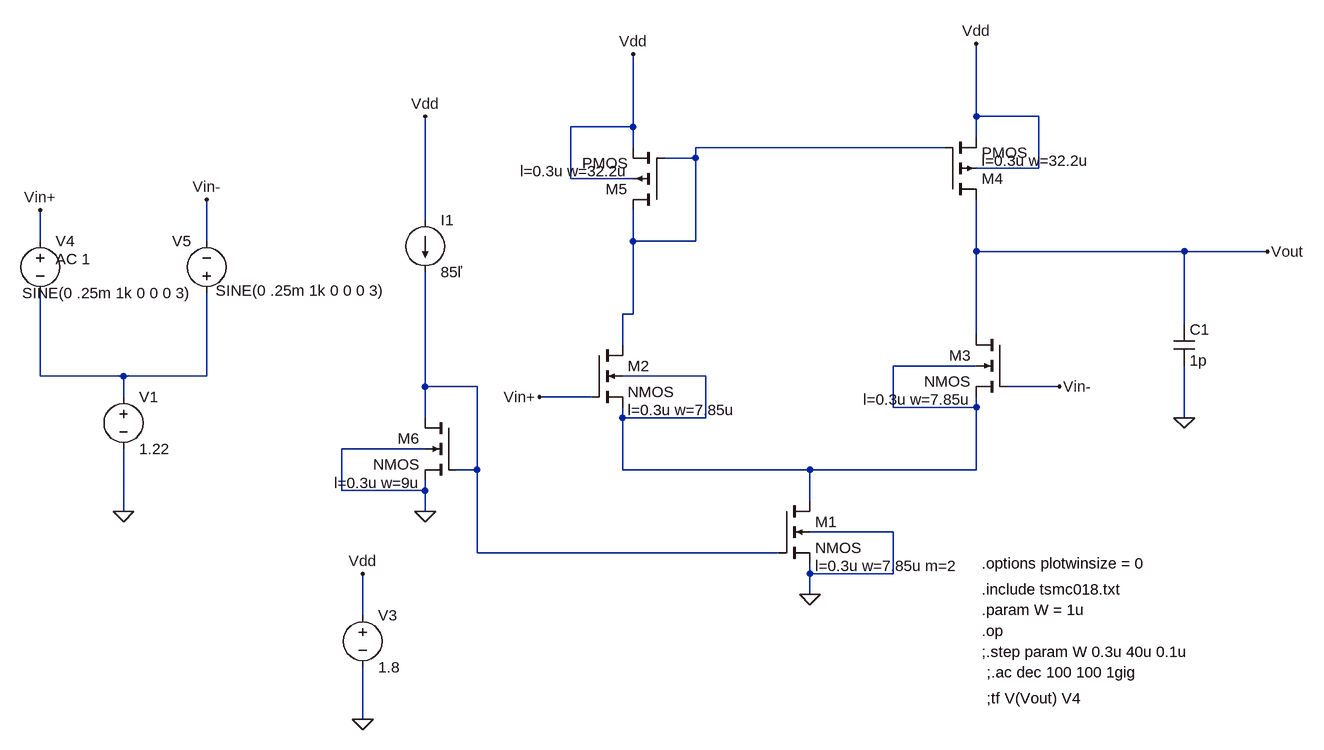
[diagram p0: schematic Op-Amp.asc]
Op-Amp.asc, the LTspice schematic file:
Version 4
SHEET 1 1016 680
WIRE 496 -384 496 -496
WIRE 592 -384 496 -384
WIRE -32 -368 -32 -480
WIRE -32 -368 -128 -368
WIRE 496 -352 496 -384
WIRE -32 -336 -32 -368
WIRE 448 -336 64 -336
WIRE 64 -320 64 -336
WIRE 64 -320 16 -320
WIRE 592 -304 592 -384
WIRE 592 -304 496 -304
WIRE -128 -288 -128 -368
WIRE -32 -288 -128 -288
WIRE -352 -224 -352 -384
WIRE -944 -192 -944 -240
WIRE -688 -192 -688 -256
WIRE -32 -192 -32 -240
WIRE 64 -192 64 -320
WIRE 64 -192 -32 -192
WIRE 496 -176 496 -256
WIRE 816 -176 496 -176
WIRE 944 -176 816 -176
WIRE -32 -80 -32 -192
WIRE -32 -80 -48 -80
WIRE 816 -64 816 -176
WIRE 496 -48 496 -176
WIRE -48 -32 -48 -80
WIRE 496 0 368 0
WIRE -944 16 -944 -112
WIRE -816 16 -944 16
WIRE -688 16 -688 -112
WIRE -688 16 -816 16
WIRE 80 16 -48 16
WIRE -352 32 -352 -144
WIRE -272 32 -352 32
WIRE 624 32 544 32
WIRE -816 48 -816 16
WIRE -96 48 -176 48
WIRE 368 64 368 0
WIRE 496 64 496 48
WIRE 496 64 368 64
WIRE -352 80 -352 32
WIRE -48 80 -48 64
WIRE 80 80 80 16
WIRE 80 80 -48 80
WIRE 816 80 816 0
WIRE -352 128 -480 128
WIRE -272 160 -272 32
WIRE -272 160 -304 160
WIRE -48 160 -48 80
WIRE 240 160 -48 160
WIRE 496 160 496 64
WIRE 496 160 240 160
WIRE -480 192 -480 128
WIRE -352 192 -352 176
WIRE -352 192 -480 192
WIRE 240 208 240 160
WIRE -816 224 -816 128
WIRE -352 224 -352 192
WIRE 368 256 240 256
WIRE -272 288 -272 160
WIRE 192 288 -272 288
WIRE 240 320 240 304
WIRE 368 320 368 256
WIRE 368 320 240 320
WIRE 240 352 240 320
WIRE -448 384 -448 320
WIRE -448 544 -448 464
FLAG 240 352 0
FLAG -32 -480 Vdd
FLAG -448 544 0
FLAG -448 320 Vdd
FLAG 496 -496 Vdd
FLAG -944 -240 Vin+
FLAG -688 -256 Vin-
FLAG 944 -176 Vout
FLAG 816 80 0
FLAG -176 48 Vin+
FLAG 624 32 Vin-
FLAG -816 224 0
FLAG -352 224 0
FLAG -352 -384 Vdd
SYMBOL nmos4 192 208 R0
WINDOW 123 56 100 Left 2
SYMATTR Value2 l=0.3u w=7.85u m=2
SYMATTR InstName M1
SYMBOL voltage -816 32 R0
WINDOW 123 0 0 Left 0
WINDOW 39 0 0 Left 0
SYMATTR InstName V1
SYMATTR Value 1.22
SYMBOL nmos4 -96 -32 R0
WINDOW 123 56 100 Left 2
SYMATTR Value2 l=0.3u w=7.85u
SYMATTR InstName M2
SYMBOL nmos4 544 -48 M0
WINDOW 123 56 100 Left 2
SYMATTR Value2 l=0.3u w=7.85u
SYMATTR InstName M3
SYMBOL pmos4 16 -240 R180
WINDOW 123 56 60 Left 2
SYMATTR Value2 l=0.3u w=32.2u
SYMATTR InstName M5
SYMBOL voltage -448 368 R0
WINDOW 123 0 0 Left 0
WINDOW 39 24 124 Left 2
SYMATTR InstName V3
SYMATTR Value 1.8
SYMBOL pmos4 448 -256 M180
WINDOW 123 56 60 Left 2
SYMATTR Value2 l=0.3u w=32.2u
SYMATTR InstName M4
SYMBOL voltage -944 -208 R0
WINDOW 3 270 92 Left 2
WINDOW 123 24 44 Left 2
WINDOW 39 0 0 Left 0
SYMATTR Value SINE(0 .25m 1k 0 0 0 3)
SYMATTR Value2 AC 1
SYMATTR InstName V4
SYMBOL voltage -688 -96 R180
WINDOW 0 24 96 Left 2
WINDOW 3 24 16 Left 2
WINDOW 123 0 0 Left 0
WINDOW 39 0 0 Left 0
SYMATTR InstName V5
SYMATTR Value SINE(0 .25m 1k 0 0 0 3)
SYMBOL cap 800 -64 R0
SYMATTR InstName C1
SYMATTR Value 1p
SYMBOL nmos4 -304 80 M0
WINDOW 123 56 100 Left 2
SYMATTR Value2 l=0.3u w=9u
SYMATTR InstName M6
SYMBOL current -352 -224 R0
WINDOW 123 0 0 Left 0
WINDOW 39 0 0 Left 0
SYMATTR InstName I1
SYMATTR Value 85ľ
TEXT 504 304 Left 2 !.options plotwinsize = 0
TEXT 504 344 Left 2 !.include tsmc018.txt
TEXT 504 376 Left 2 !.param W = 1u
TEXT 504 408 Left 2 !.op
TEXT 504 440 Left 2 !;.step param W 0.3u 40u 0.1u
TEXT 512 472 Left 2 !;.ac dec 100 100 1gig
TEXT 512 512 Left 2 !;tf V(Vout) V4

The netlist it stands for:
* Op-Amp.asc
M1 N002 N004 0 0 NMOS l=0.3u w=7.85u m=2
V1 N003 0 1.22
M2 N001 Vin+ N002 N002 NMOS l=0.3u w=7.85u
M3 Vout Vin- N002 N002 NMOS l=0.3u w=7.85u
M5 N001 N001 Vdd Vdd PMOS l=0.3u w=32.2u
V3 Vdd 0 1.8
M4 Vout N001 Vdd Vdd PMOS l=0.3u w=32.2u
V4 Vin+ N003 SINE(0 .25m 1k 0 0 0 3) AC 1
V5 N003 Vin- SINE(0 .25m 1k 0 0 0 3)
C1 Vout 0 1p
M6 N004 N004 0 0 NMOS l=0.3u w=9u
I1 Vdd N004 85ľ
.model NMOS NMOS
.model PMOS PMOS
.lib standard.mos
.options plotwinsize = 0
.include tsmc018.txt
.param W = 1u
.op
;.step param W 0.3u 40u 0.1u
;.ac dec 100 100 1gig
;tf V(Vout) V4
.backanno
.end